# EAGLE schematic dashboard-pcbsch@aveon (EAGLE 9.6.2)
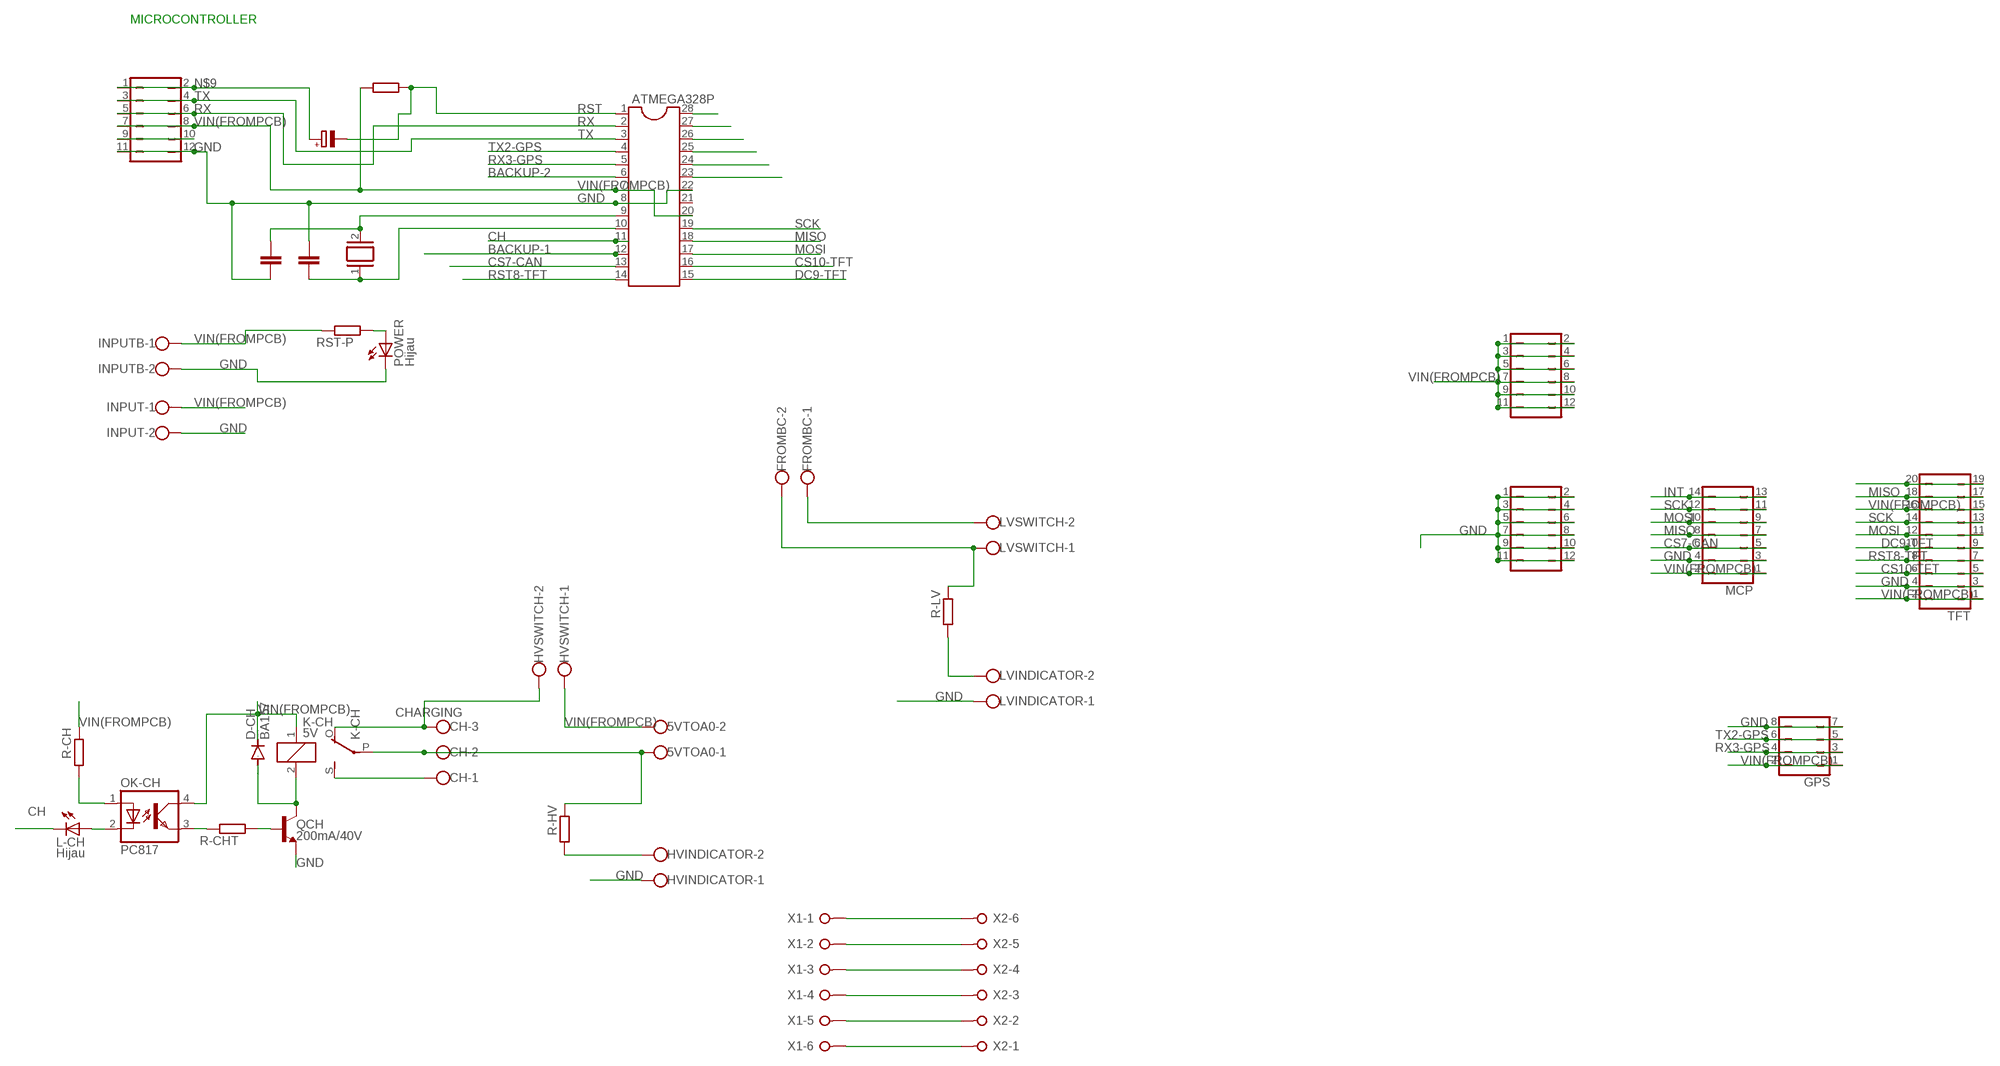
[diagram p0: schematic, sheet 1]

## Parts
5VTOA0  W237-102  [W237-102]
ATMEGA328P  DIL28-3  [DIL28-3]
C1  C-EU025-030X050  [C025-030X050]
C2  C-EU025-030X050  [C025-030X050]
CH  CHARGING  W237-103  [W237-103]
CRYSTAL  XTAL/S  [QS]
D-CH  BA157  [P1-10]
FROMBC  W237-102  [W237-102]
GPS  JP4Q  [JP4Q]
GROUND  JP6Q  [JP6Q]
HVINDICATOR  W237-102  [W237-102]
HVSWITCH  W237-102  [W237-102]
INPUT  W237-102  [W237-102]
INPUTB  W237-102  [W237-102]
K-CH  5V  ZF112  [ZF112]
L-CH  Hijau  LED3MM  [LED3MM]
LVINDICATOR  W237-102  [W237-102]
LVSWITCH  W237-102  [W237-102]
MCP  JP7Q  [JP7Q]
OK-CH  PC817  [DIL04]
POWER  Hijau  LED3MM  [LED3MM]
PROGRAMMER  JP6Q  [JP6Q]
QCH  200mA/40V  TRANS_NPN-2N3904  [TO-92]
R-CH  R-EU_0204/7  [0204/7]
R-CHT  R-EU_0204/7  [0204/7]
R-HV  R-EU_0204/7  [0204/7]
R-LV  R-EU_0204/7  [0204/7]
RST-C  CPOL-EUE2.5-6  [E2,5-6]
RST-P  R-EU_0204/7  [0204/7]
RST-R  R-EU_0204/7  [0204/7]
TFT  JP10Q  [JP10Q]
VIN(FROMPC)  JP6Q  [JP6Q]
X1  W237-06P  [W237-6P]
X2  W237-06P  [W237-6P]

## Nets
BACKUP-1: ATMEGA328P.12
BACKUP-2: ATMEGA328P.6
CH: ATMEGA328P.11 L-CH.K(C)
CS7-CAN: ATMEGA328P.13 MCP.5 MCP.6
CS10-TFT: ATMEGA328P.16 TFT.5 TFT.6
DC9-TFT: ATMEGA328P.15 TFT.9 TFT.10
GND: ATMEGA328P.8 ATMEGA328P.22 C1.1 C2.2 GPS.7 GPS.8 GROUND.1 GROUND.2 GROUND.3 GROUND.4 GROUND.5 GROUND.6 GROUND.7 GROUND.8 GROUND.9 GROUND.10 GROUND.11 GROUND.12 HVINDICATOR.1 INPUT.2 INPUTB.2 LVINDICATOR.1 MCP.3 MCP.4 POWER.K(C) PROGRAMMER.11 PROGRAMMER.12 QCH.1(E) TFT.3 TFT.4
INT: MCP.13 MCP.14
MISO: ATMEGA328P.18 MCP.7 MCP.8 TFT.17 TFT.18
MOSI: ATMEGA328P.17 MCP.9 MCP.10 TFT.11 TFT.12
N$1: POWER.A RST-P.1
N$5: FROMBC.1 LVSWITCH.2
N$6: FROMBC.2 LVSWITCH.1 R-LV.2
N$7: LVINDICATOR.2 R-LV.1
N$9: PROGRAMMER.1 PROGRAMMER.2 RST-C.+
N$13: ATMEGA328P.9 C1.2 CRYSTAL.2
N$14: X1.1 X2.6
N$16: ATMEGA328P.26
N$17: ATMEGA328P.25
N$18: X1.2 X2.5
N$19: X1.3 X2.4
N$20: ATMEGA328P.24
N$21: X1.4 X2.3
N$22: L-CH.A OK-CH.2(C)
N$23: CH.3 HVSWITCH.2 K-CH.O(2:O)
N$24: OK-CH.1(A) R-CH.1
N$25: OK-CH.3(EMIT) R-CHT.2
N$26: D-CH.A K-CH.2 QCH.3(C)
N$27: ATMEGA328P.23
N$28: QCH.2(B) R-CHT.1
N$29: CH.1 K-CH.S(2:S)
N$30: 5VTOA0.1 CH.2 K-CH.P(2:P) R-HV.2
N$31: X1.5 X2.2
N$32: HVINDICATOR.2 R-HV.1
N$33: X1.6 X2.1
N$42: TFT.19 TFT.20
N$62: ATMEGA328P.10 C2.1 CRYSTAL.1
N$66: PROGRAMMER.9 PROGRAMMER.10
N$87: ATMEGA328P.28
N$88: ATMEGA328P.27
RST: ATMEGA328P.1 RST-C.- RST-R.2
RST8-TFT: ATMEGA328P.14 TFT.7 TFT.8
RX: ATMEGA328P.2 PROGRAMMER.5 PROGRAMMER.6
RX3-GPS: ATMEGA328P.5 GPS.3 GPS.4
SCK: ATMEGA328P.19 MCP.11 MCP.12 TFT.13 TFT.14
TX: ATMEGA328P.3 PROGRAMMER.3 PROGRAMMER.4
TX2-GPS: ATMEGA328P.4 GPS.5 GPS.6
VIN(FROMPCB): 5VTOA0.2 ATMEGA328P.7 ATMEGA328P.20 D-CH.C GPS.1 GPS.2 HVSWITCH.1 INPUT.1 INPUTB.1 K-CH.1 MCP.1 MCP.2 OK-CH.4(COL) PROGRAMMER.7 PROGRAMMER.8 R-CH.2 RST-P.2 RST-R.1 TFT.1 TFT.2 TFT.15 TFT.16 VIN(FROMPC).1 VIN(FROMPC).2 VIN(FROMPC).3 VIN(FROMPC).4 VIN(FROMPC).5 VIN(FROMPC).6 VIN(FROMPC).7 VIN(FROMPC).8 VIN(FROMPC).9 VIN(FROMPC).10 VIN(FROMPC).11 VIN(FROMPC).12
Unconnected: ATMEGA328P.21

## Notes on the sheet
- MICROCONTROLLER

## Library data of the parts
5VTOA0 FROMBC HVINDICATOR HVSWITCH INPUT INPUTB LVINDICATOR LVSWITCH = con-wago-500:W237-102: WAGO SCREW CLAMP; MPN: 237-102; OC_FARNELL: unknown; OC_NEWARK: 70K9898
ATMEGA328P = ic-package:DIL28: Dual In Line
C1 C2 = rcl:C-EU: CAPACITOR, European symbol; SPICEPREFIX: C
CH = con-wago-500:W237-103: WAGO SCREW CLAMP; MPN: 237-103; OC_FARNELL: unknown; OC_NEWARK: 18M7116
CRYSTAL = special:XTAL/S: CRYSTAL
D-CH = diode:BA157: DIODE fast soft-recovery controlled avalanche rectifier
GPS = jumper:JP4Q: JUMPER
GROUND PROGRAMMER VIN(FROMPC) = jumper:JP6Q: JUMPER
K-CH = relay:ZF112: RELAY 1 x switch; OC_FARNELL: unknown; OC_NEWARK: unknown
L-CH POWER = led:LED: LED OSRAM: - CHIPLED LG R971, LG N971, LY N971, LG Q971, LY Q971, LO R971, LY R971 LH N974, LH R974 LS Q976, LO Q976, LY Q976 LO Q996 - Hyper CHIPLED LW Q18S LB Q993, LB Q99A, LB R99A - SideLED LS A670, LO A670, LY A670, LG A670, LP A670 LB A673, LV A673, LT A673, LW A673 LH A674 LY A675 LS A676, LA A676, LO A676, LY A676, LW A676 LS A679, LY A679, LG A679 - Hyper Micro SIDELED® LS Y876, LA Y876, LO Y876, LY Y876 LT Y87S - SmartLED LW L88C, LW L88S LB L89C, LB L89S, LG L890 LS L89K, LO L89K, LY L89K LS L896, LA L896, LO L896, LY L896 - TOPLED LS T670, LO T670, LY T670, LG T670, LP T670 LSG T670, LSP T670, LSY T670, LOP T670, LYG T670 LG T671, LOG T671, LSG T671 LB T673, LV T673, LT T673, LW T673 LH T674 LS T676, LA T676, LO T676, LY T676, LB T676, LH T676, LSB T676, LW T676 LB T67C, LV T67C, LT T67C, LS T67K, LO T67K, LY T67K, LW E67C LS E67B, LA E67B, LO E67B, LY E67B, LB E67C, LV E67C, LT E67C LW T67C LS T679, LY T679, LG T679 LS T770, LO T770, LY T770, LG T770, LP T770 LB T773, LV T773, LT T773, LW T773 LH T774 LS E675, LA E675, LY E675, LS T675 LS T776, LA T776, LO T776, LY T776, LB T776 LHGB T686 LT T68C, LB T68C - Hyper Mini TOPLED® LB M676 - Mini TOPLED Santana® LG M470 LS M47K, LO M47K, LY M47K Source: http://www.osram.convergy.de LUXEON: - LUMILED® LXK2-PW12-R00, LXK2-PW12-S00, LXK2-PW14-U00, LXK2-PW14-V00 LXK2-PM12-R00, LXK2-PM12-S00, LXK2-PM14-U00 LXK2-PE12-Q00, LXK2-PE12-R00, LXK2-PE12-S00, LXK2-PE14-T00, LXK2-PE14-U00 LXK2-PB12-K00, LXK2-PB12-L00, LXK2-PB12-M00, LXK2-PB14-N00, LXK2-PB14-P00, LXK2-PB14-Q00 LXK2-PR12-L00, LXK2-PR12-M00, LXK2-PR14-Q00, LXK2-PR14-R00 LXK2-PD12-Q00, LXK2-PD12-R00, LXK2-PD12-S00 LXK2-PH12-R00, LXK2-PH12-S00 LXK2-PL12-P00, LXK2-PL12-Q00, LXK2-PL12-R00 Source: www.luxeon.com KINGBRIGHT: KA-3528ASYC Source: www.kingbright.com
MCP = jumper:JP7Q: JUMPER
OK-CH = optocoupler:PC817: SHARP OPTO COUPLER; MPN: PC817X4J000F; OC_FARNELL: 9707727; OC_NEWARK: 97K7059
QCH = SparkFun-DiscreteSemi:TRANS_NPN: NPN transistor Current controlled devices typically used to amplify current or used as a switch. BC547 - COM-08928 <http://www.sparkfun.com/products/8928> (TO-92 45V 100mA) (1.Collector 2.Base 3.Emitter) 2N3904 - COM-00521 <http://www.sparkfun.com/products/521> (TO-92 40V 200mA) (1.Emitter 2.Base 3.Collector) P2N2222A - COM-12852 <http://www.sparkfun.com/products/12852> (TO-92 40V 600mA) (1.Collector 2.Base 3.Emitter); PROD_ID: TRANS-08447
R-CH R-CHT R-HV R-LV RST-P RST-R = rcl:R-EU_: RESISTOR, European symbol; SPICEPREFIX: R
RST-C = rcl:CPOL-EU: POLARIZED CAPACITOR, European symbol; SPICEPREFIX: C
TFT = jumper:JP10Q: JUMPER
X1 X2 = con-wago-508:W237-06P: WAGO SREW CLAMP; OC_FARNELL: unknown; OC_NEWARK: unknown